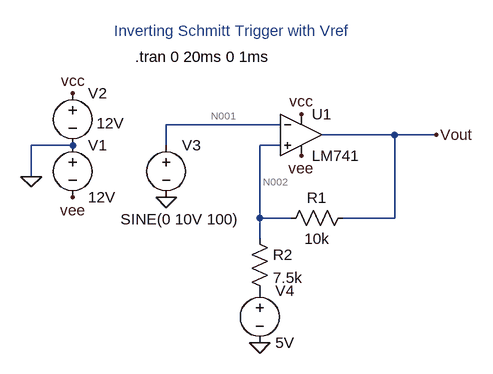
[diagram p0: schematic inverting_comparator.asc]
inverting_comparator.asc, the LTspice schematic file:
Version 4.1
SHEET 1 880 680
WIRE 288 144 112 144
WIRE 464 160 352 160
WIRE 528 160 464 160
WIRE -32 176 -96 176
WIRE 112 176 112 144
WIRE 288 176 256 176
WIRE -96 224 -96 176
WIRE 256 288 256 176
WIRE 304 288 256 288
WIRE 464 288 464 160
WIRE 464 288 384 288
WIRE 256 320 256 288
FLAG -96 224 0
FLAG -32 96 vcc
FLAG -32 256 vee
FLAG 320 128 vcc
FLAG 320 192 vee
FLAG 112 256 0
FLAG 256 480 0
FLAG 528 160 Vout
SYMBOL voltage -32 160 R0
WINDOW 123 0 0 Left 0
WINDOW 39 0 0 Left 0
SYMATTR InstName V1
SYMATTR Value 12V
SYMBOL voltage -32 80 R0
WINDOW 3 37 62 Left 2
WINDOW 123 0 0 Left 0
WINDOW 39 0 0 Left 0
SYMATTR InstName V2
SYMATTR Value 12V
SYMBOL LM741 320 96 R0
SYMATTR InstName U1
SYMBOL voltage 112 160 R0
WINDOW 3 -70 130 Left 2
WINDOW 123 0 0 Left 0
WINDOW 39 0 0 Left 0
SYMATTR InstName V3
SYMATTR Value SINE(0 10V 100)
SYMBOL res 400 272 R90
WINDOW 0 0 56 VBottom 2
WINDOW 3 32 56 VTop 2
SYMATTR InstName R1
SYMATTR Value 10k
SYMBOL res 240 304 R0
SYMATTR InstName R2
SYMATTR Value 7.5k
SYMBOL voltage 256 384 R0
WINDOW 123 0 0 Left 0
WINDOW 39 0 0 Left 0
SYMATTR InstName V4
SYMATTR Value 5V
TEXT 32 0 Left 2 ;Inverting Schmitt Trigger with Vref
TEXT 64 40 Left 2 !.tran 0 20ms 0 1ms

The netlist it stands for:
* inverting_comparator.asc
V1 0 vee 12V
V2 vcc 0 12V
X§U1 N002 N001 vcc vee Vout LM741  ; pins In+ In- V+ V- OUT
V3 N001 0 SINE(0 10V 100)
R1 Vout N002 10k
R2 N002 P001 7.5k
V4 P001 0 5V
* Inverting Schmitt Trigger with Vref
.tran 0 20ms 0 1ms
.lib LM741.lib
.backanno
.end

* Results of the author's LTspice run, read from the files saved beside the schematic
* Operating Point, zero values left out:
*   V(vcc) = 12 V
*   V(vout) = 10.98 V
*   V(vee) = -12 V
*   V(n002) = 7.498 V
*   V(p001) = 5 V
*   I(V1) = -1.563 mA
*   I(R1) = 348.2 µA
*   I(V4) = 333.1 µA
*   I(R2) = 333.1 µA
*   I(V2) = -1.911 mA
*   I(V3) = 14.98 µA
*   Ix(u1:1) = 15.14 µA
*   Ix(u1:2) = -14.98 µA
*   Ix(u1:99) = 1.911 mA
*   Ix(u1:50) = -1.563 mA
*   Ix(u1:28) = -348.2 µA
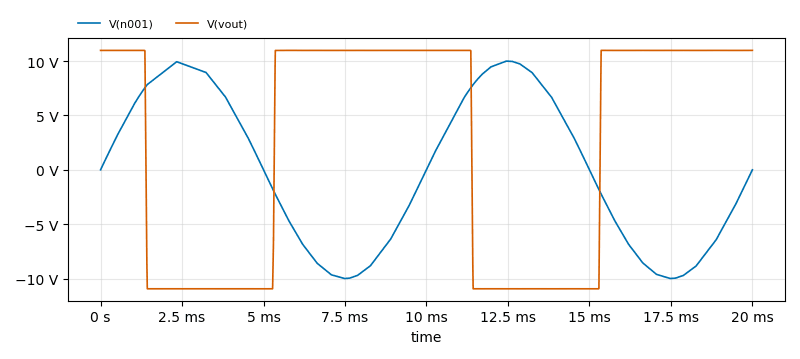
[diagram p1: Transient Analysis of inverting_comparator.asc, plotted from the saved traces]
* Transient Analysis, 1 run:
*   V(n001): min -10 V, max 9.995 V, average -21 mV, rms 7.069 V, last 0 V
*   V(vout): min -10.94 V, max 10.98 V, average 2.365 V, rms 10.92 V, last 10.98 V